# EAGLE schematic Apo Board 2017_large (EAGLE 7.6.0)
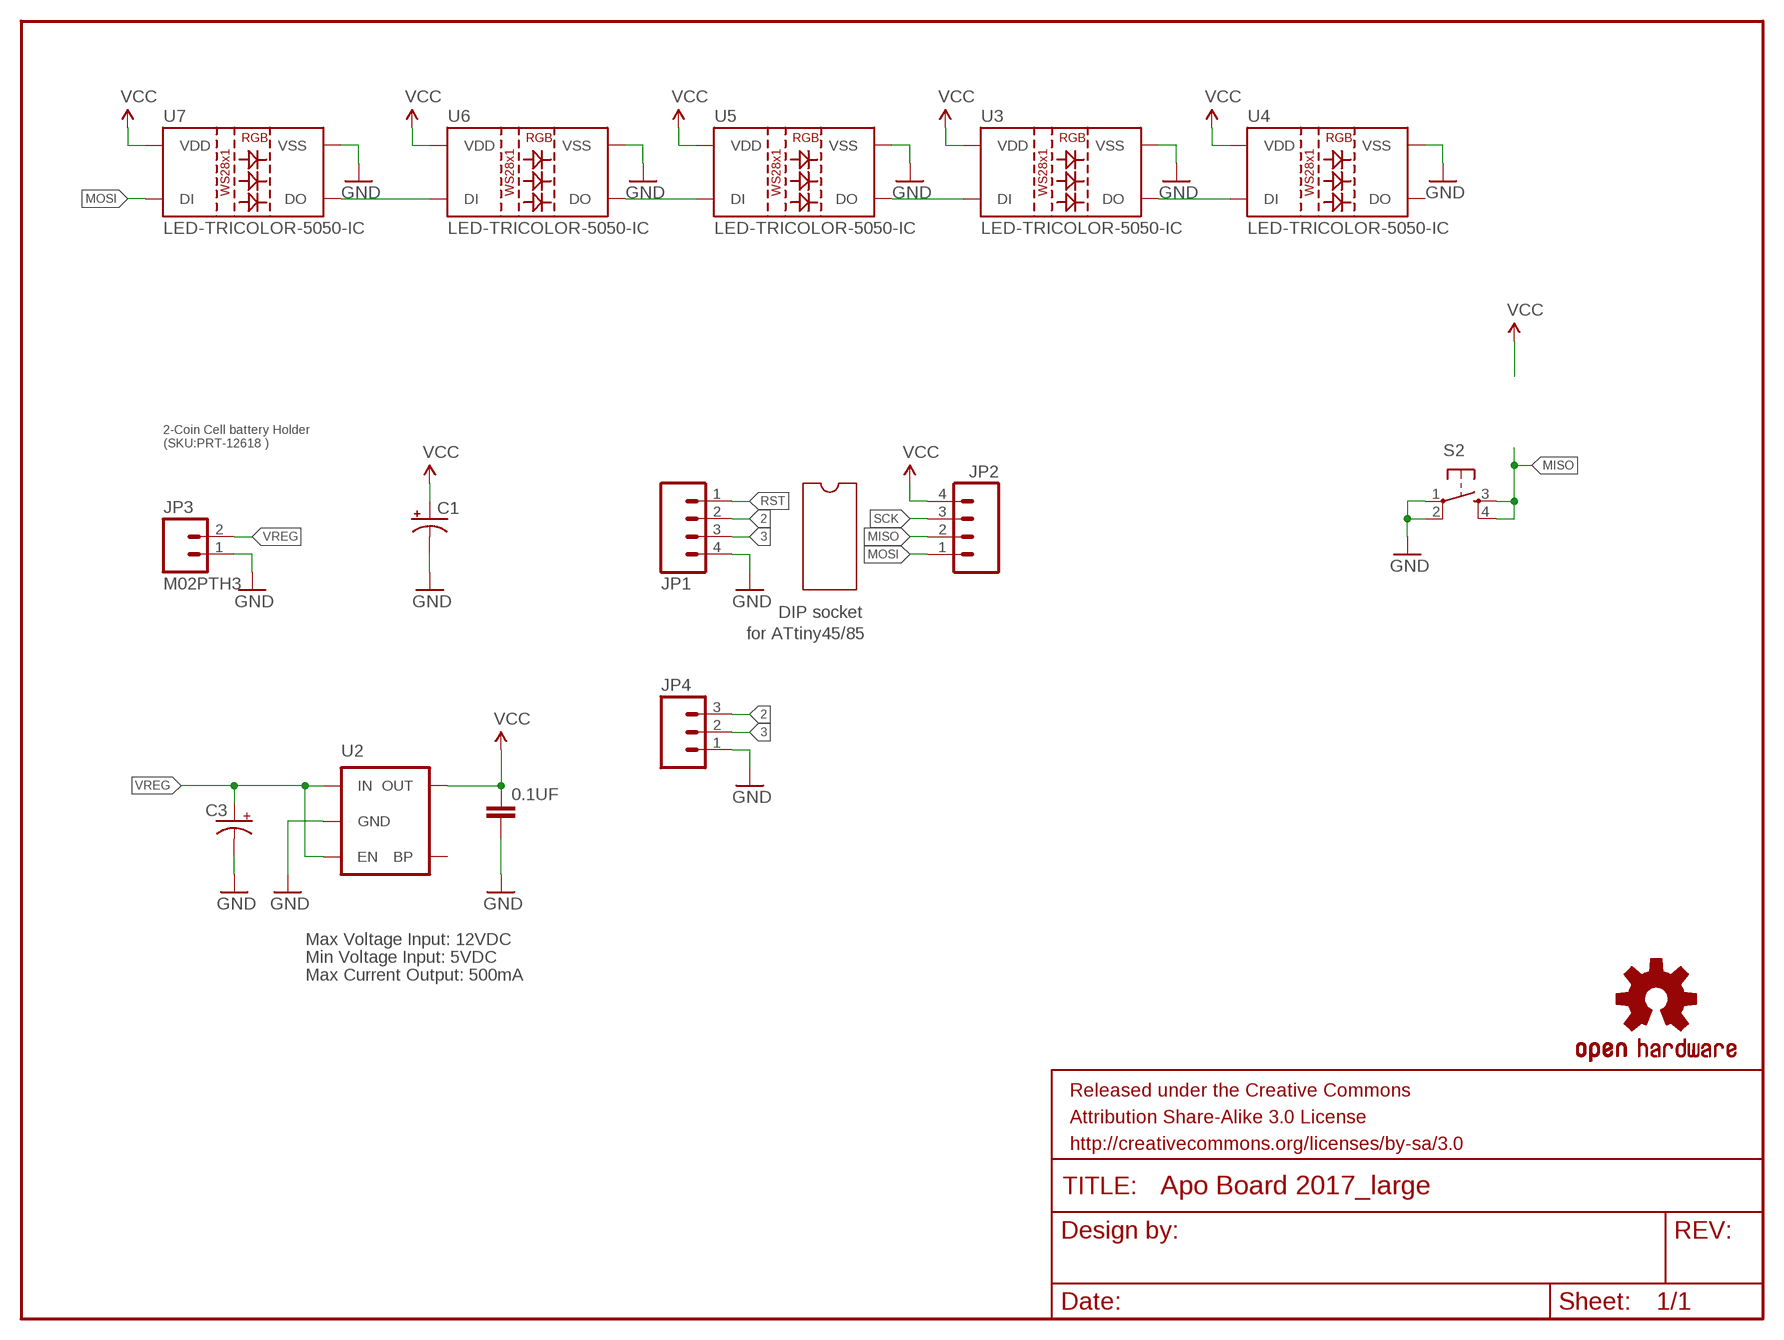
[diagram p0: schematic, sheet 1]

## Parts
0.1UF  CAPKIT  [CAP-PTH-SMALL-KIT]
C1  CAP_POLPTH2  [CPOL-RADIAL-10UF-25V]
C3  CAP_POLPTH2  [CPOL-RADIAL-10UF-25V]
FRAME1  FRAME-LETTER  [CREATIVE_COMMONS]
JP1  M04PTH  [1X04]
JP2  M04PTH  [1X04]
JP3  M02PTH3  [1X02_LONGPADS]
JP4  M031X03_NO_SILK  [1X03_NO_SILK]
LOGO1  OSHW-LOGOS  [OSHW-LOGO-S]
S2  TAC_SWITCHPTH  [TACTILE-PTH]
U2  MIC52055V  [SOT23-5]
U3  LED-TRICOLOR-5050-IC  [LED-RGB-THRU]
U4  LED-TRICOLOR-5050-IC  [LED-RGB-THRU]
U5  LED-TRICOLOR-5050-IC  [LED-RGB-THRU]
U6  LED-TRICOLOR-5050-IC  [LED-RGB-THRU]
U7  LED-TRICOLOR-5050-IC  [LED-RGB-THRU]

## Nets
2: JP1.2 JP4.3
3: JP1.3 JP4.2
GND: 0.1UF.2 C1.2(-) C3.2(-) JP1.4 JP3.1 JP4.1 S2.1 S2.2 U2.2(GND) U3.3(VSS) U4.3(VSS) U5.3(VSS) U6.3(VSS) U7.3(VSS)
MISO: JP2.2 S2.3 S2.4
MOSI: JP2.1 U7.1(DI)
N$1: U6.1(DI) U7.4(DO)
N$2: U5.1(DI) U6.4(DO)
N$5: U3.1(DI) U5.4(DO)
N$6: U3.4(DO) U4.1(DI)
RST: JP1.1
SCK: JP2.3
VCC: 0.1UF.1 C1.1(+) JP2.4 U2.5(OUT) U3.2(VDD) U4.2(VDD) U5.2(VDD) U6.2(VDD) U7.2(VDD)
VREG: C3.1(+) JP3.2 U2.1(IN) U2.3(EN)
Unconnected: U2.4(BP) U4.4(DO)

## Notes on the sheet
- 2-Coin Cell battery Holder
  (SKU:PRT-12618 )
- DIP socket
- for ATtiny45/85
- Max Voltage Input: 12VDC
- Min Voltage Input: 5VDC
- Max Current Output: 500mA

## Library data of the parts
0.1UF = SparkFun-Capacitors:CAP: Capacitor Standard 0603 ceramic capacitor, and 0.1" leaded capacitor.
C1 C3 = SparkFun-Capacitors:CAP_POL: Capacitor Polarized These are standard SMD and PTH capacitors. Normally 10uF, 47uF, and 100uF in electrolytic and tantalum varieties. Always verify the external diameter of the through hole cap, it varies with capacity, voltage, and manufacturer. The EIA devices should be standard.
FRAME1 = SparkFun-Aesthetics:FRAME-LETTER: Schematic Frame Standard 8.5x11 US Letter frame
JP1 JP2 = SparkFun-Connectors:M04: Header 4 Standard 4-pin 0.1" header. Use with straight break away headers (SKU : PRT-00116), right angle break away headers (PRT-00553), swiss pins (PRT-00743), machine pins (PRT-00117), and female headers (PRT-00115). Molex polarized connector foot print use with SKU : PRT-08231 with associated crimp pins and housings. 1MM SMD Version SKU: PRT-10208
JP3 = SparkFun-Connectors:M02: Standard 2-pin 0.1" header. Use with - straight break away headers ( PRT-00116) - right angle break away headers (PRT-00553) - swiss pins (PRT-00743) - machine pins (PRT-00117) - female headers (PRT-00115) Molex polarized connector foot print use with: PRT-08233 with associated crimp pins and housings. 2.54_SCREWTERM for use with PRT-10571. 3.5mm Screw Terminal footprints for PRT-08084 5mm Screw Terminal footprints for use with PRT-08433
JP4 = SparkFun-Connectors:M03: Header 3 Standard 3-pin 0.1" header. Use with straight break away headers (SKU : PRT-00116), right angle break away headers (PRT-00553), swiss pins (PRT-00743), machine pins (PRT-00117), and female headers (PRT-00115). Molex polarized connector foot print use with SKU : PRT-08232 with associated crimp pins and housings.
LOGO1 = SparkFun-Aesthetics:OSHW-LOGO: Open Source Hardware Logo This logo indicates the piece of hardware it is found on incorporates a OSHW license and/or adheres to the definition of open source hardware found here: http://freedomdefined.org/OSHW
S2 = SparkFun-Electromechanical:TAC_SWITCH: Momentary Switch Button commonly used for reset or general input. Spark Fun Electronics SKU : COM-00097 SMT- SWCH-08247
U2 = SparkFun-PowerIC:MIC5205: MIC5205 150mA vreg 3.3V - VREG-00822 5V - VREG-00823; PROD_ID: VREG-00823
U3-U7 = SparkFun-LED:LED-TRICOLOR-5050-IC: WS2811 RGB LED w/driver 5x5mm SMD LED with built-in controller IC. DIO-11598

## Net classes
0 Default: width 0.203 mm